# EAGLE design LED-control (EAGLE 8.2.2)
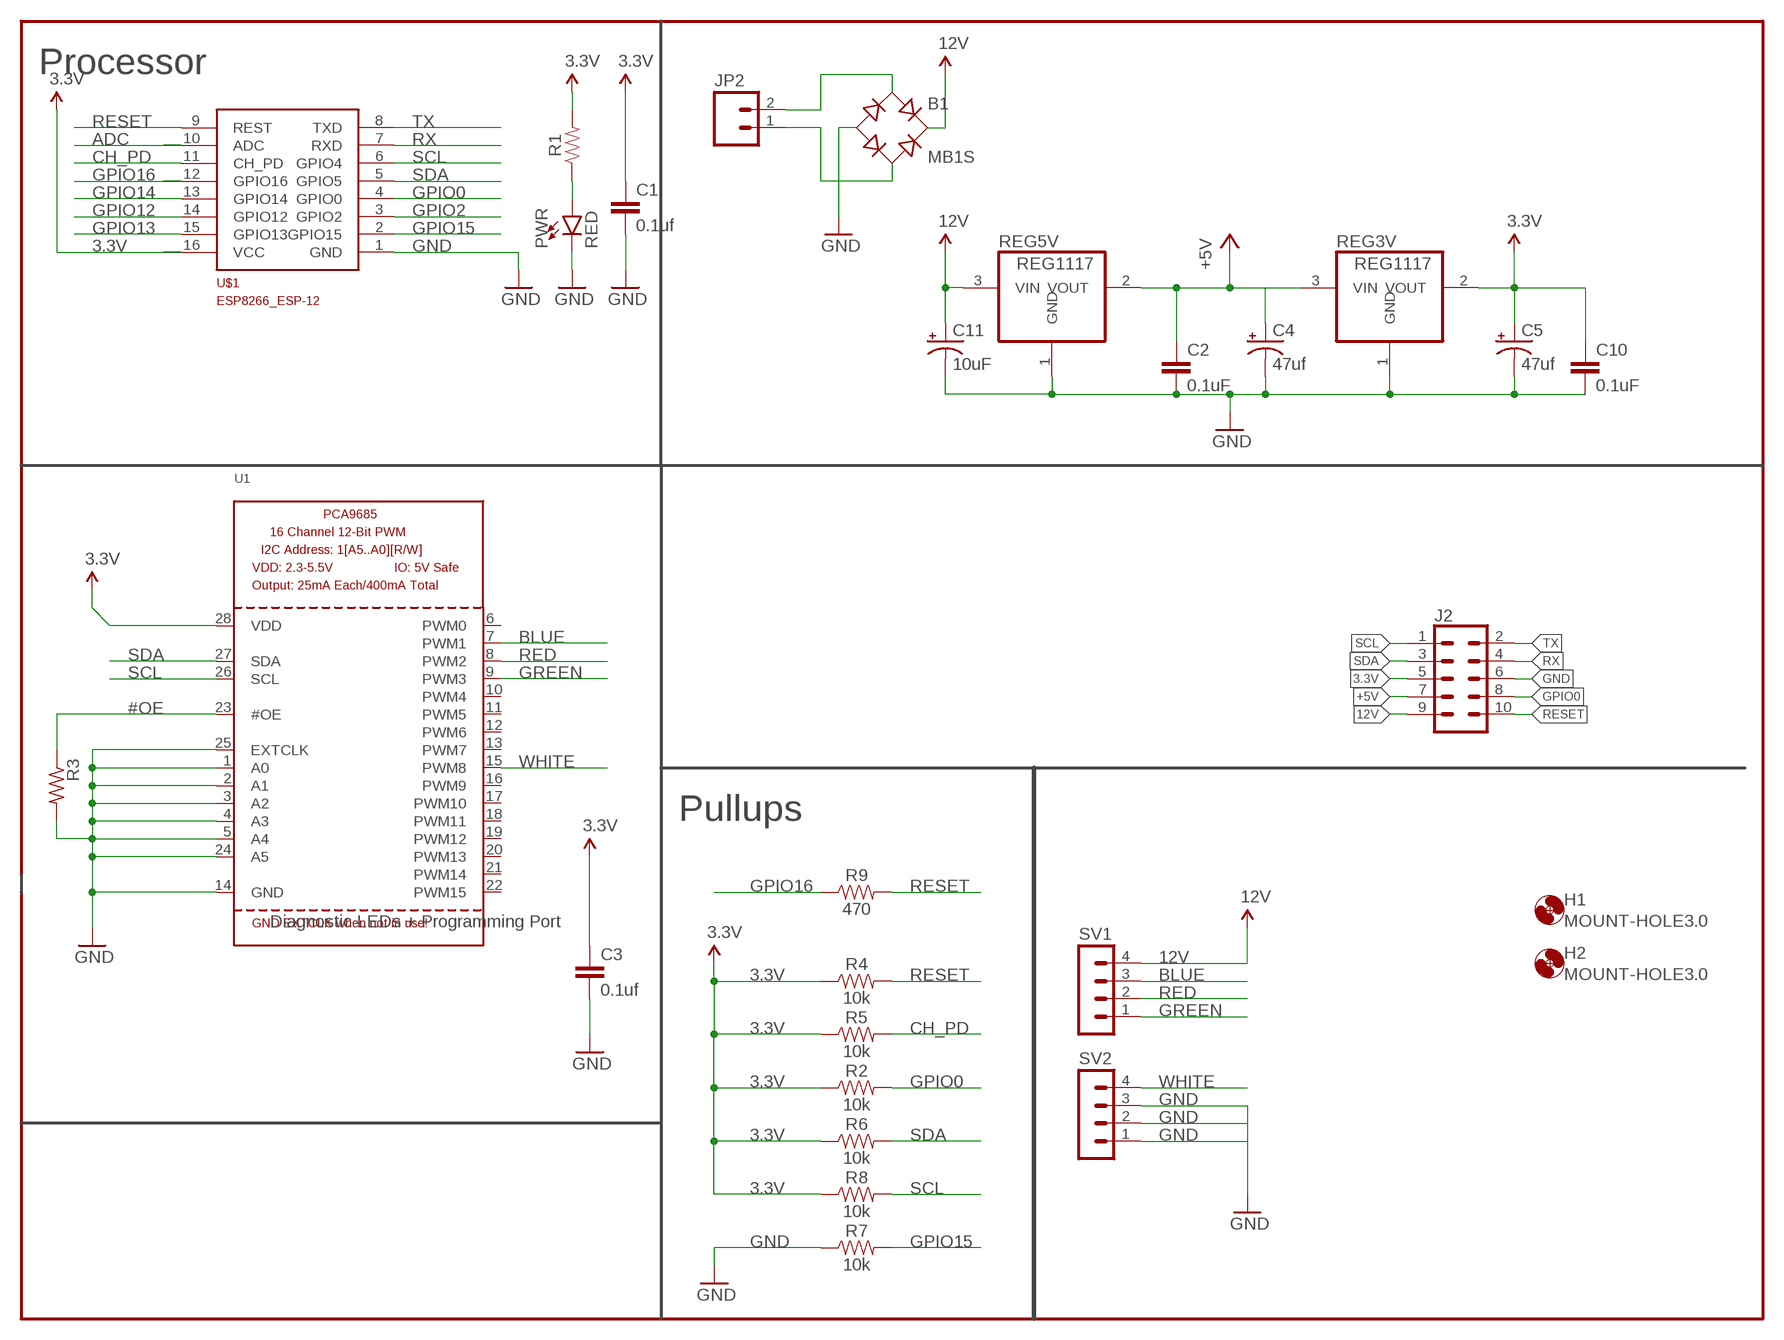
[diagram p0: schematic, sheet 1]

## Parts
B1  MB1S  [SOIC-4]
C1  0.1uf  C-EUC1206  [C1206]
C2  0.1uF  C-EUC1206  [C1206]
C3  0.1uf  C-EUC1206  [C1206]
C4  47uf  CAP_POLC  [PANASONIC_C]
C5  47uf  CAP_POLC  [PANASONIC_C]
C10  0.1uF  C-EUC1206  [C1206]
C11  10uF  10UF-TANT  [EIA3216]
FRAME1  FRAME-LETTERNO_PACKAGE  [DUMMY]
H1  MOUNT-HOLE3.0  [3,0]
H2  MOUNT-HOLE3.0  [3,0]
J2  CONN_05X2SHD  [2X5-SHROUDED]
JP2  M02JST-PTH-VERT  [JST-2-PTH-VERT]
PWR  RED  LED-RED1206  [LED-1206]
R1  RESISTOR1206  [1206]
R2  10k  RESISTOR1206  [1206]
R3  R-US_R1206  [R1206]
R4  10k  RESISTOR1206  [1206]
R5  10k  RESISTOR1206  [1206]
R6  10k  RESISTOR1206  [1206]
R7  10k  RESISTOR1206  [1206]
R8  10k  RESISTOR1206  [1206]
R9  470  RESISTOR1206  [1206]
REG3V  REG1117  [SOT223]
REG5V  REG1117  [SOT223]
SV1  MA04-1  [MA04-1]
SV2  MA04-1  [MA04-1]
U1  PCA9685  [TSSOP28]
U$1  ESP8266_ESP-12  [ESP8266-ESP12]

## Nets
3.3V: C1.1 C3.1 C5.+ C10.1 J2.5 R1.2 R2.1 R4.1 R5.1 R6.1 R8.1 REG3V.2(VOUT) U1.28(VDD) U$1.16(VCC)
12V: B1.+ C11.A(+) J2.9 REG5V.3(VIN) SV1.4
#OE: R3.1 U1.23(#OE)
+5V: C2.1 C4.+ J2.7 REG3V.3(VIN) REG5V.2(VOUT)
ADC: U$1.10(ADC)
BLUE: SV1.3 U1.7(PWM1)
CH_PD: R5.2 U$1.11(CH_PD)
GND: B1.- C1.2 C2.2 C3.2 C4.- C5.- C10.2 C11.C(-) J2.6 PWR.C R3.2 R7.1 REG3V.1(GND) REG5V.1(GND) SV2.1 SV2.2 SV2.3 U1.1(A0) U1.2(A1) U1.3(A2) U1.4(A3) U1.5(A4) U1.14(GND) U1.24(A5) U1.25(EXTCLK) U$1.1(GND)
GPIO0: J2.8 R2.2 U$1.4(GPIO0)
GPIO2: U$1.3(GPIO2)
GPIO12: U$1.14(GPIO12)
GPIO13: U$1.15(GPIO13)
GPIO14: U$1.13(GPIO14)
GPIO15: R7.2 U$1.2(GPIO15)
GPIO16: R9.1 U$1.12(GPIO16)
GREEN: SV1.1 U1.9(PWM3)
N$2: PWR.A R1.1
N$3: B1.~1(AC1) JP2.2
N$4: B1.~2(AC2) JP2.1
RED: SV1.2 U1.8(PWM2)
RESET: J2.10 R4.2 R9.2 U$1.9(REST)
RX: J2.4 U$1.7(RXD)
SCL: J2.1 R8.2 U1.26(SCL) U$1.6(GPIO4)
SDA: J2.3 R6.2 U1.27(SDA) U$1.5(GPIO5)
TX: J2.2 U$1.8(TXD)
WHITE: SV2.4 U1.15(PWM8)
Unconnected: U1.6(PWM0) U1.10(PWM4) U1.11(PWM5) U1.12(PWM6) U1.13(PWM7) U1.16(PWM9) U1.17(PWM10) U1.18(PWM11) U1.19(PWM12) U1.20(PWM13) U1.21(PWM14) U1.22(PWM15)

## Notes on the sheet
- Processor
- Pullups
- Diagnostic LEDs + Programming Port

## Library data of the parts
B1 = rectifier:MB*S: Bridge Rectifier Source: http://www.fairchildsemi.com/ds/MB/MB6S.pdf
C1-C3 C10 = rcl:C-EU: CAPACITOR, European symbol
C4 C5 = SparkFun-Capacitors:CAP_POL: Capacitor Polarized These are standard SMD and PTH capacitors. Normally 10uF, 47uF, and 100uF in electrolytic and tantalum varieties. Always verify the external diameter of the through hole cap, it varies with capacity, voltage, and manufacturer. The EIA devices should be standard.
C11 = SparkFun-Retired:10UF-TANT: 10uF Tantalum SMT CAP-00811- 16V 10% (EIA-3216); PROD_ID: CAP-00811
FRAME1 = SparkFun-Aesthetics:FRAME-LETTER: Schematic Frame Standard 8.5x11 US Letter frame; DESIGNER: Nobody; VERSION: v01
H1 H2 = holes:MOUNT-HOLE: MOUNTING HOLE with drill center marker
J2 = SparkFun-Connectors:CONN_05X2: Multi connection point. Often used as Generic Header-pin footprint for 0.1 inch spaced/style header connections For AVR SPI programming port, see special device with nice symbol: "AVR_SPI_PROG_5x2.dev" You can populate with any combo of single row headers, but if you'd like an exact match, check these: 2x5 AVR ICSP Male Header <https://www.sparkfun.com/products/778> (PRT-00778) 2x5 Pin Shrouded Header <https://www.sparkfun.com/products/8506> (PRT-08506) On any of the 0.1 inch spaced packages, you can populate with these: Break Away Headers - Straight <https://www.sparkfun.com/products/116> (PRT-00116) Break Away Male Headers - Right Angle <https://www.sparkfun.com/products/553> (PRT-00553) Female Headers <https://www.sparkfun.com/products/115> (PRT-00115) Break Away Headers - Machine Pin <https://www.sparkfun.com/products/117> (PRT-00117) Break Away Female Headers - Swiss Machine Pin <https://www.sparkfun.com/products/743> (PRT-00743) Special note: the shrouded connector mates well with our 5x2 ribbon cables: 2x5 Pin IDC Ribbon Cable <https://www.sparkfun.com/products/8535> (PRT-08535); PROD_ID: CONN-08671; SF_ID: PRT-08506
JP2 = SparkFun-Connectors:M02: Standard 2-pin 0.1" header. Use with - straight break away headers ( PRT-00116) - right angle break away headers (PRT-00553) - swiss pins (PRT-00743) - machine pins (PRT-00117) - female headers (PRT-00115) Molex polarized connector foot print use with: PRT-08233 with associated crimp pins and housings. 2.54_SCREWTERM for use with PRT-10571. 3.5mm Screw Terminal footprints for PRT-08084 5mm Screw Terminal footprints for use with PRT-08432
PWR = SparkFun-LED:LED-RED: Red SMD LED Used in manufacturing of most products at SparkFun Packages: 0603 - SMD 0603 package [Product Link] <http://docs.avagotech.com/docs/AV02-0551EN> 0603 SMART - SMD 0603 SMART package ( more efficient and expensive)[Product Link] <http://www.osram-os.com/Graphics/XPic2/00077099_0.pdf> 1206 - SMD1206 package [Product Link] <https://www.sparkfun.com/datasheets/DevTools/LilyPad/Q150OVS4.pdff> SparkFun Products: Pro Mini 328 -5V <https://www.sparkfun.com/products/821> RedBoard <https://www.sparkfun.com/products/12757> IOIO-OTG <https://www.sparkfun.com/products/13613>; PROD_ID: DIO-09912
R1 R2 R4-R9 = SparkFun-Resistors:RESISTOR: Generic Resistor Package
R3 = rcl:R-US_: RESISTOR, American symbol
REG3V REG5V = burr-brown:REG1117: 800mA and 1A Low Dropout (LDO) Positive Regulator 1.8V, 2.5V, 2.85V, 3.3V, 5V, and Adj; MPN: REG1117; OC_FARNELL: 1097566; OC_NEWARK: 14P6981
SV1 SV2 = con-lstb:MA04-1: PIN HEADER; OC_FARNELL: unknown; OC_NEWARK: unknown
U1 = adafruit:PCA9685: PCA9685 - 16 Channel 12-Bit I2C PWM Controller 5.0V tolerant 16 channel, 12-bit I2C PWM controller with 25mA per output (max. 400mA total) Digikey: 568-5931-1-ND
U$1 = ESP8266-ESP12:ESP8266_ESP-12

## Board
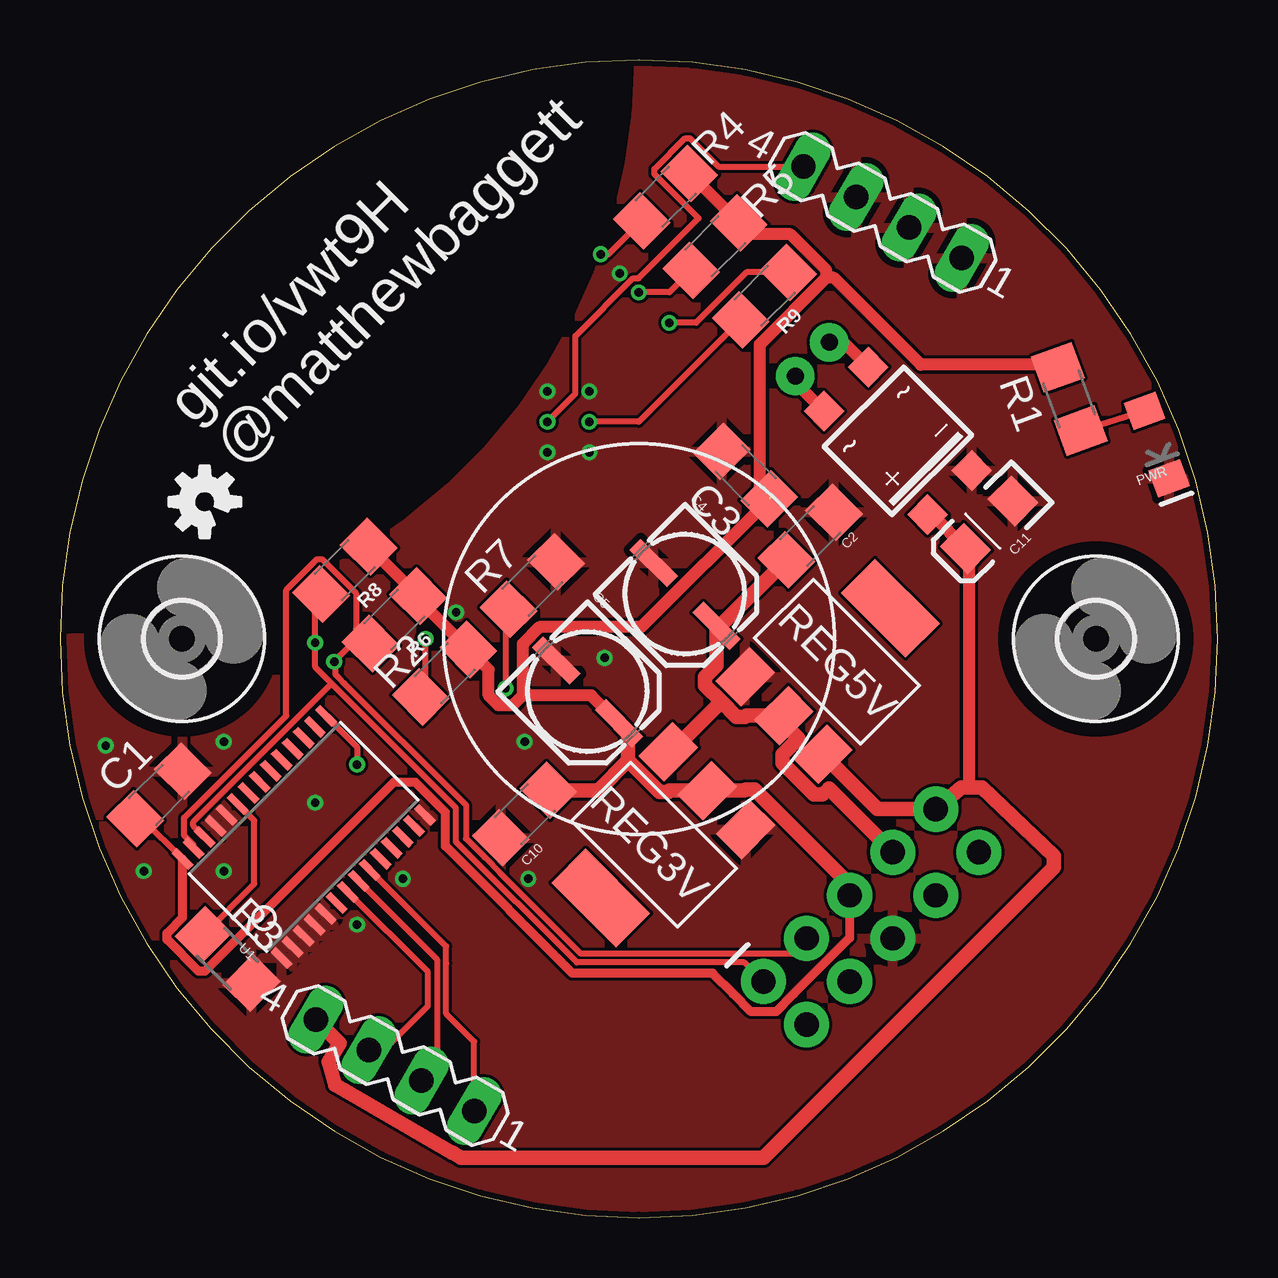
[diagram p1: board, top side]
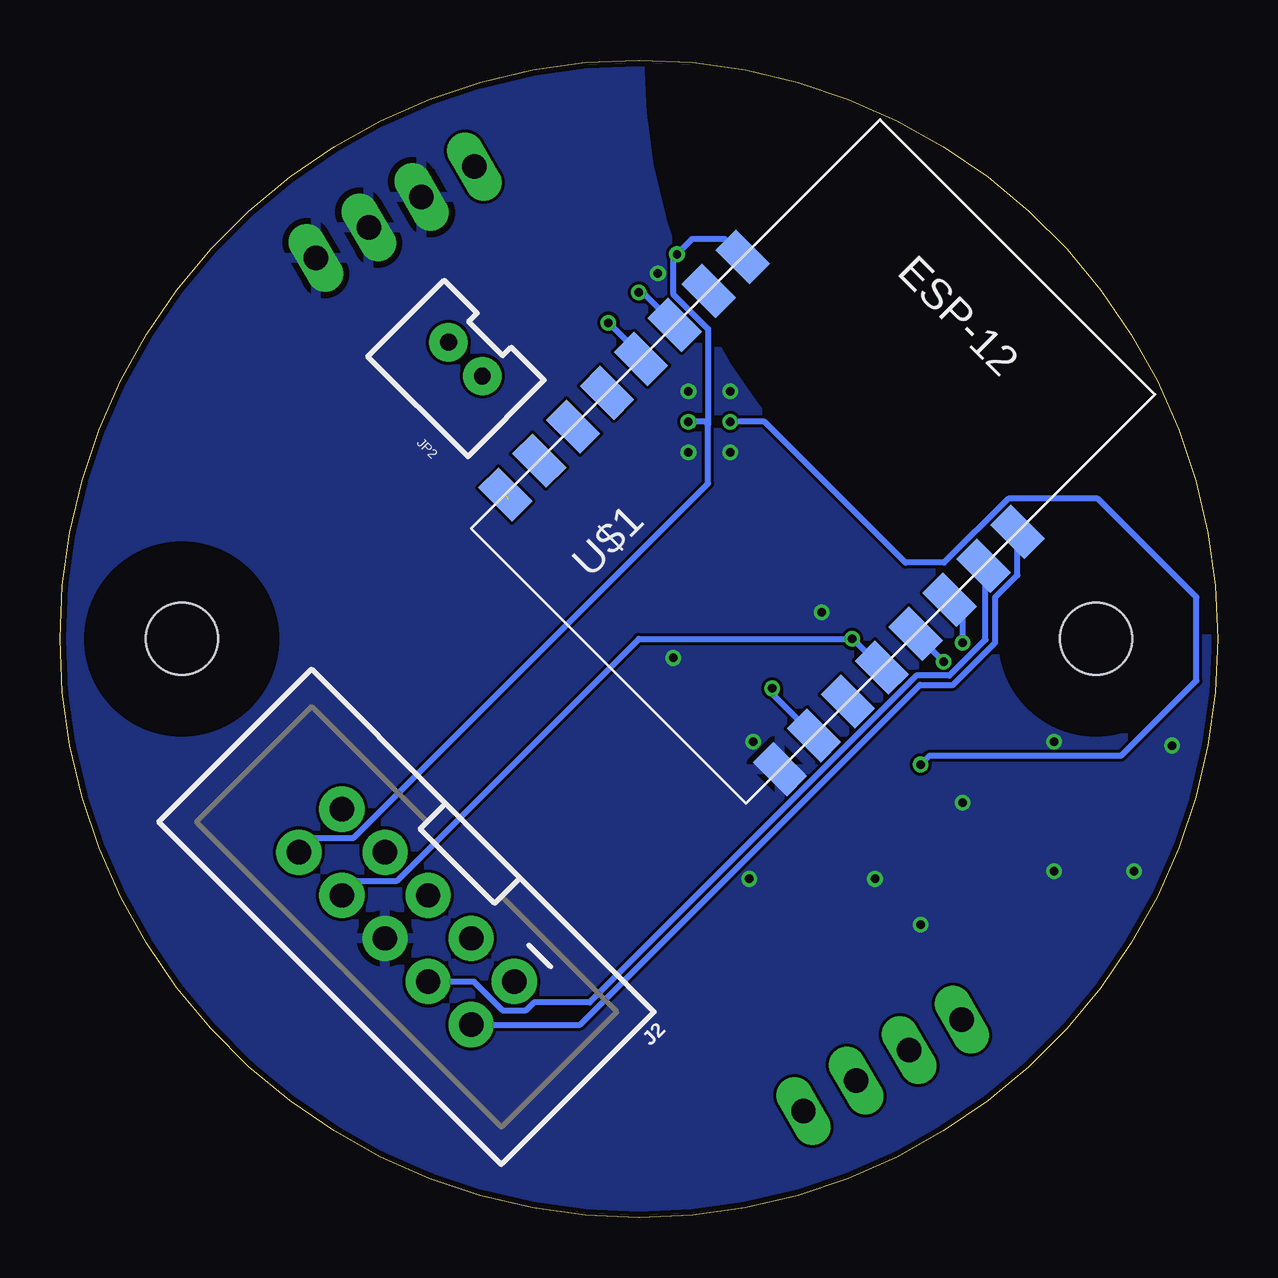
[diagram p2: board, bottom side, seen from below]

Size 48.26 x 48.26 mm. Coordinates in mm from the lower left corner, seen from the top.
Outline: 24.13,0 arc90 48.26,24.13 arc90 24.13,48.26 arc90 0,24.13 arc90 24.13,0
Copper layers (1*16): Top 0.035mm / dielectric 1.5mm / Bottom 0.035mm
Design rules "dirtypcbs": minimum track width 5mil, minimum drill 12mil, track to track 5mil, track to pad 5mil, pad to pad 5mil, via to via 5mil, smd to smd 0mil, copper to edge 10mil, drill to drill 10mil, minimum pad ring 10mil, minimum via ring 6mil, stop-mask expansion 2mil, vias tented up to drill 25mil, thermal gap 10mil

### Footprints (pad centres in the part's own frame; a part is rotated, then mirrored left to right if it is on the bottom)
SOIC-4 = smd 1.2 x 1.2: + 1.3,3.05; - -1.3,3.05; ~1 -1.3,-3.05; ~2 1.3,-3.05
C1206 = smd 1.6 x 1.8: 1 -1.4,0; 2 1.4,0
PANASONIC_C = smd 2.2 x 0.65: + 1.9,-0.2; - -1.8,-0.2
EIA3216 = smd 1.4 x 1.6: A 1.4,0; C -1.4,0
3,0 = hole 3: 0,0
2X5-SHROUDED = drill 1.016 pad 1.88: 1 -1.27,5.08; 2 1.27,5.08; 3 -1.27,2.54; 4 1.27,2.54; 5 -1.27,0; 6 1.27,0; 7 -1.27,-2.54; 8 1.27,-2.54; 9 -1.27,-5.08; 10 1.27,-5.08
JST-2-PTH-VERT = drill 0.7 pad 1.6: 1 -1,-0.55; 2 1,-0.55
LED-1206 = smd 1.2 x 1.4: A -1.5,0; C 1.5,0
1206 = smd 1.6 x 1.8: 1 -1.4,0; 2 1.4,0
R1206 = smd 1.6 x 1.803: 1 -1.422,0; 2 1.422,0
SOT223 = smd 1.499 x 2.007: 1 -2.261,-3.15; 2 0.025,-3.15; 3 2.311,-3.15 | smd 3.81 x 2.007: 4 0,3.15
MA04-1 = drill 1.016 long: 1 -3.81,0; 2 -1.27,0; 3 1.27,0; 4 3.81,0
TSSOP28 = smd 0.305 x 0.991: 1 -4.225,-2.918; 2 -3.575,-2.918; 3 -2.925,-2.918; 4 -2.275,-2.918; 5 -1.625,-2.918; 6 -0.975,-2.918; 7 -0.325,-2.918; 8 0.325,-2.918; 9 0.975,-2.918; 10 1.625,-2.918; 11 2.275,-2.918; 12 2.925,-2.918; 13 3.575,-2.918; 14 4.225,-2.918; 15 4.225,2.918; 16 3.575,2.918; 17 2.925,2.918; 18 2.275,2.918; 19 1.625,2.918; 20 0.975,2.918; 21 0.325,2.918; 22 -0.325,2.918; 23 -0.975,2.918; 24 -1.625,2.918; 25 -2.275,2.918; 26 -2.925,2.918; 27 -3.575,2.918; 28 -4.225,2.918
ESP8266-ESP12 = smd 2 x 1.2: 1 16.2,2; 2 16.2,4; 3 16.2,6; 4 16.2,8; 5 16.2,10; 6 16.2,12; 7 16.2,14; 8 16.2,16; 9 0,16; 10 0,14; 11 0,12; 12 0,10; 13 0,8; 14 0,6; 15 0,4; 16 0,2

### Placement (x,y rotation side)
B1  34.92,32.38 225 top
C1  4.13,17.62 45 top
C2  31.27,28.42 45 top
C3  28.57,30.96 135 top
C4  26.16,26.16 315 top
C5  22.1,22.1 315 top
C10  19.37,16.83 225 top
C11  38.73,28.89 225 top
FRAME1  0.16,0.48 0 top
H1  43.18,24.13 0 top
H2  5.08,24.13 0 top
J2  33.81,12.54 225 bottom
JP2  31.75,35.4 135 bottom
LOGO3  OSHW-LOGOS  [OSHW-LOGO-S]  6.03,29.84 45 top
PWR  45.72,32.23 290 top
R1  42.07,34.13 110 top
R2  16.03,22.7 225 top
R3  6.99,10.79 315 top
R4  25.24,42.55 225 top
R5  27.3,40.48 225 top
R6  13.94,24.92 225 top
R7  19.68,26.35 225 top
R8  11.88,26.99 225 top
R9  29.37,38.42 225 top
REG3V  24.77,15.56 135 top
REG5V  32.38,23.18 315 top
SV1  13.97,6.35 150 top
SV2  34.29,41.91 150 top
U1  10.16,15.88 45 top
U$1  31.11,28.73 315 bottom

### Tracks (layer width: path | path; a pad name or v marks a point on that pad's centre or on a via)
3.3V  (1 unrouted)
  Top 0.254: U1.28 3.43,16.63 C1.1
  Top 0.381: J2.5 32.92,11.66 30.58,9.33 29.84,8.59 28.8,8.59 28.07,9.33 27.2,10.19 21.36,10.19 16.07,15.49 16.07,16.9 14.81,18.15 13.91,18.15 6.04,10.28 5.78,10.28 4.46,11.6 4.46,11.86 5.11,12.51 U1.28
  Top 0.508: R4.1 R5.1 28.78,40.99 30.45,40.99 31.94,39.49 31.94,39.18 | R8.1 R6.1 14.93,25.78 R2.1 17.86,22.85 17.86,21.77 18.28,21.36 18.87,21.36 19.28,21.77 | 19.28,21.77 19.28,23.92 19.98,24.62 24.22,24.62 C3.1 29.17,30.36 29.17,36.41 31.94,39.18 | C5.+ 22.14,21.77 19.28,21.77 | R1.2 41.48,35.56 35.88,35.56 32.26,39.18 31.94,39.18
  Top 0.61: 23.69,19.06 25,17.75 25.36,17.75 25.41,17.8 REG3V.2 28.54,17.8 28.59,17.86 28.95,17.86 32.92,13.89 J2.5 | C5.+ 23.69,20.23 23.69,19.06 | C10.1 22.44,17.82 23.69,19.06
12V
  Top 0.508: B1.+ 36.34,29.31 C11.A 37.88,27.77 37.88,17.94
  Top 0.61: REG5V.3 34.08,17.03 J2.9 37.57,17.94 37.88,17.94 38.42,17.94 41.43,15.08 41.43,14.61 29.33,2.5 16.72,2.5 16.38,2.7 16.35,2.7 11.86,5.31 11.46,5.54 11.21,6.49 11.66,7.27 SV1.4
#OE
  Top 0.254: U1.23 8.1,16.56 8.1,13.92 R3.1
+5V
  Top 0.61: 29.83,20.93 REG5V.2 | 29.83,20.93 28.61,20.93 28.56,20.88 28.2,20.88 27.56,21.52 | 27.56,21.52 26.89,22.19 26.89,22.55 27.36,23.02 C4.+ 27.54,24.68 C2.1 | REG3V.3 25.47,19.42 27.56,21.52 | 29.83,20.93 30.78,19.98 30.12,19.32 30.12,18.96 31.43,17.64 31.79,17.64 32.05,17.9 J2.7
BLUE
  Top 0.254: SV1.3 13.49,6.99 15.34,8.83 15.34,10.24 U1.7
CH_PD  (via drill 0.35)
  Top 0.254: R5.2 25.4,38.58 v24.13,38.58
  Bottom 0.254: U$1.11 23.99,38.58 v24.13,38.58
GND  (via drill 0.35)
  other vias: 22.7,23.34 16.51,25.24 22.07,34.45 20.32,34.45 10.64,17.3 3.49,14.45 6.83,14.45 6.83,19.84 1.91,19.68 19.37,19.84 12.38,12.22 14.29,14.13 19.53,14.13 20.32,31.91 22.07,31.91 23.34,39.37
  pour Top: 0,24.13 arc90 24.13,0 arc90 48.26,24.13 arc90 24.13,48.26 arc-90
  pour Bottom: 24.13,0 arc90 48.26,24.13 arc90 24.13,48.26 arc-90 0,24.13 arc90
GPIO0  (via drill 0.35)
  Top 0.254: R2.2 15.24,21.91 v15.24,24.13
  Bottom 0.254: U$1.4 15.2,24.13 v15.24,24.13 24.13,24.13 34.22,14.04 35.91,14.04 J2.8
GPIO15  (via drill 0.35)
  Top 0.254: R7.2 18.57,25.24 v18.57,22.07
  Bottom 0.254: U$1.2 18.57,21.85 v18.57,22.07
GPIO16  (via drill 0.35)
  Top 0.254: R9.1 28.61,39.41 26.51,37.31 v25.4,37.31
  Bottom 0.254: U$1.12 24.04,35.95 v25.4,37.31
GREEN
  Top 0.254: SV1.1 17.27,7.34 16.1,8.51 16.1,10.62 | 16.1,10.62 | 16.1,10.62 16.1,11.32 U1.9
N$2
  Top 0.254: R1.1 PWR.A
N$3
  Top 0.508: B1.~1 32.65,36.5 JP2.2
N$4
  Top 0.508: B1.~2 30.65,34.82 JP2.1
RED
  Top 0.254: U1.8 15.72,10.78 15.72,6.83 15.07,6.18 SV1.2
RESET  (via drill 0.35)
  Top 0.254: R4.2 22.86,40.16 v22.54,40.16 | R9.2 24.13,33.18 v22.07,33.18
  Bottom 0.254: U$1.9 20.55,40.8 21.91,40.8 v22.54,40.16 22.7,40.01 22.7,38.5 22.11,37.9 21.24,37.04 21.24,33.06 | J2.10 37.7,15.84 36.01,15.84 21.24,30.61 21.24,33.06 | 21.24,33.06 21.36,33.18 v22.07,33.18
RX
  Bottom 0.254: J2.4 31.01,9.85 29.82,8.65 28.83,8.65 28.5,8.98 26.19,8.98 12.57,22.6 11.19,22.6 9.68,24.1 9.68,27.1 U$1.7 9.42,26.84
SCL  (via drill 0.35)
  Top 0.254: J2.1 28.53,10.64 21.55,10.64 16.51,15.68 16.51,17.08 | 16.51,17.08 | R8.2 10.64,25.75 v10.64,23.97 10.64,22.96 11.32,22.27 | 11.32,22.27 11.47,22.12 16.3,17.29 16.51,17.08 | U1.26 5.56,16.34 5.56,16.51 11.32,22.27 | 16.51,17.08
  Bottom 0.254: U$1.6 10.64,25.23 v10.64,23.97
SDA  (via drill 0.35)
  Top 0.254: 17.71,15.01 18.34,14.38 21.7,11.02 30.5,11.02 J2.3 | 17.71,15.01 | 17.71,15.01 16.92,15.8 16.92,17.21 16.67,17.46 | 16.67,17.46 11.85,22.28 11.63,22.5 11.47,22.66 11.47,23.14 v11.43,23.18 12.19,23.93 R6.2 12.34,24.54 12.34,26.03 10.92,27.45 10.71,27.45 9.43,26.17 9.43,20.92 5.17,16.67 5.17,15.94 5.57,15.54 U1.27 | 16.67,17.46
  Bottom 0.254: U$1.5 v11.43,23.19 v11.43,23.18
TX
  Bottom 0.254: J2.2 26.57,8.05 12.41,22.21 11.03,22.21 9.27,23.98 9.27,25.87 8.35,26.79 U$1.8
WHITE  (via drill 0.35)
  Top 0.254: U1.15 12.38,19.63 v12.38,18.89 | v20.32,33.18 21.48,34.34 21.48,36.75 23.89,39.16 24.12,39.16 26.62,41.66 24.77,43.5 24.77,43.71 26.05,44.99 26.27,44.99 27.44,43.81 SV2.4
  Bottom 0.254: v12.38,18.89 12.01,19.26 4.02,19.26 0.89,22.39 0.89,25.87 5,29.98 8.73,29.98 11.41,27.3 13.02,27.3 18.89,33.18 v20.32,33.18

### Text on the board
tNames: git.io/vwt9H | @matthewbaggett